# Altium project YA-IoT-Node.PrjPcb
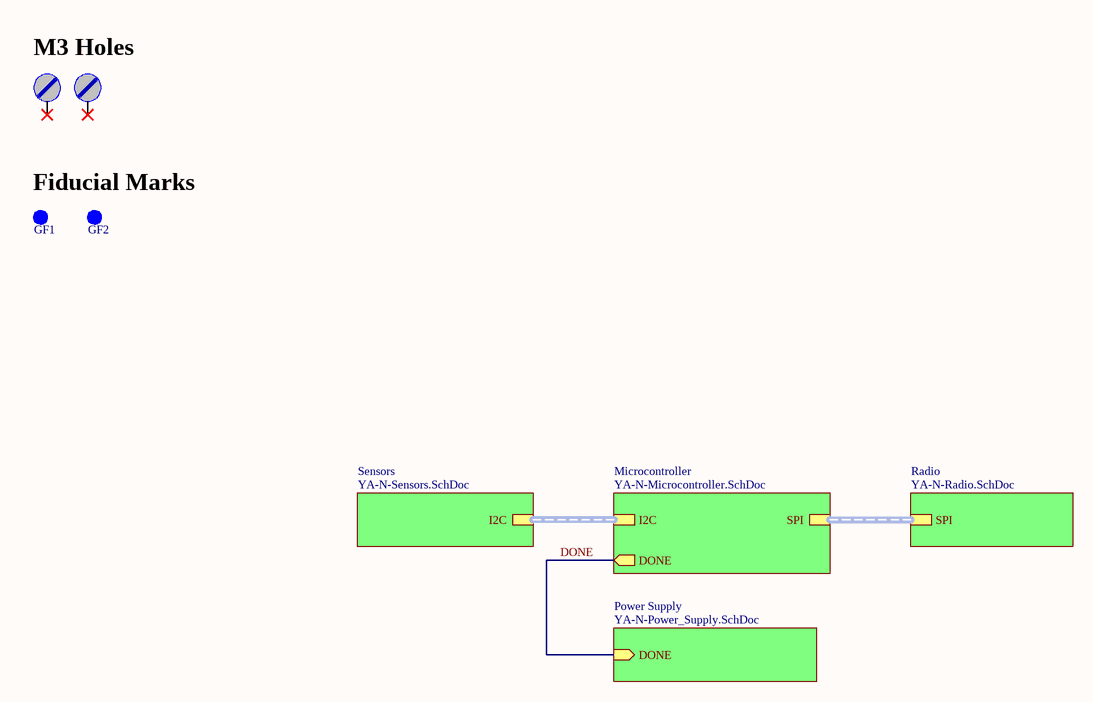
[diagram p0: YA-N-Block.SchDoc]
5 sheets, 98 parts. Net scope: hierarchical (ports join the sheet entries above them; power ports are global).
Board file: YA-N-PCB.PcbDoc
Sheets:
  YA-N-Block.SchDoc
    Sensors = YA-N-Sensors.SchDoc
    Radio = YA-N-Radio.SchDoc
    Microcontroller = YA-N-Microcontroller.SchDoc
    Power Supply = YA-N-Power_Supply.SchDoc

## Sheet YA-N-Block.SchDoc: Yet Another IoT Node - Blocks
size A4; Revision: 2.0; SheetNumber: 1; SheetTotal: 5

### Parts
GF1  Fiducial  [FIDUCIAL]  (value not drawn)  (no BOM)
GF2  Fiducial  [FIDUCIAL]  (value not drawn)  (no BOM)
M1  Furo de Fixação  [Furo_M3]  (value not drawn)  (no BOM)
M2  Furo de Fixação  [Furo_M3]  (value not drawn)  (no BOM)

### Sub-sheets
Microcontroller = YA-N-Microcontroller.SchDoc: I2C (harness I2C), SPI (harness SPI), DONE (out)
Power Supply = YA-N-Power_Supply.SchDoc: DONE (in)
Radio = YA-N-Radio.SchDoc: SPI (harness SPI)
Sensors = YA-N-Sensors.SchDoc: I2C (harness I2C)

### Nets
DONE: sheet Microcontroller/DONE, sheet Power Supply/DONE

Not connected (* = marked no-connect by the designer): M1 X*; M2 X*

### Buses and harness runs
harness sheet Microcontroller/I2C = sheet Sensors/I2C
harness sheet Microcontroller/SPI = sheet Radio/SPI

### Notes on the sheet
- M3 Holes
- Fiducial Marks
- Projeto:
- Tamanho:
- Data:
- A4
- Eng. Felipe Navarro
- Hora:
- Revisão:
- Folha
- de
- Arquivo:

### Library data of the parts
GF1 GF2 = Fiducial: Guia Fiducial; ChinesePrice: 0,00000; Chinês: ----; Corrente: *; Potência: *; Supplier 1: Digi-Key; Supplier Part Number 1: --Del; Tensão: *; Value: *; Obs:: *; Tolerância: *; ComponentLink1Description: Datasheet; ComponentLink1URL: D:\Tecnoclade\Datasheet\
M1 M2 = Parafuso: Furo para parafuso; Value: M3; ChinesePrice: 0,00000; Chinês: ----; Supplier 1: Digi-Key; Supplier Part Number 1: --Del; Corrente: *; Potência: *; Tensão: *; Tolerância: *; Obs:: *; ComponentLink1Description: Datasheet; ComponentLink1URL: D:\Tecnoclade\Datasheet\!DataMissing.pdf

## Sheet YA-N-Sensors.SchDoc: Yet Another IoT Node - Sensors
size A4; Revision: 2.0; SheetNumber: 5; SheetTotal: 5
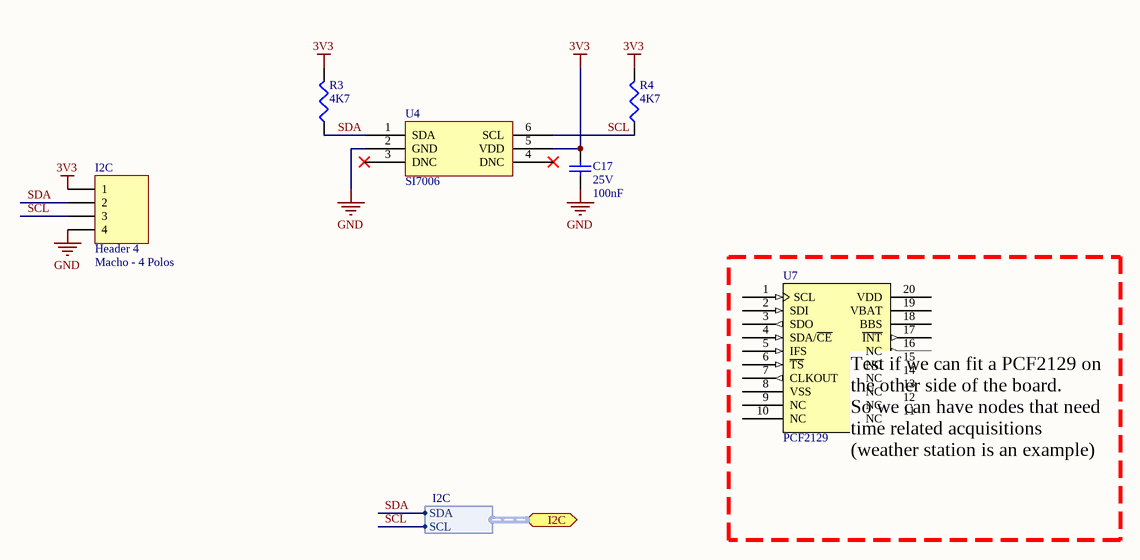
[diagram p1: YA-N-Sensors.SchDoc]

### Parts
C17  value 100nF  Tensão: 25V  [CC0603]  (hidden comment: Capacitor Cerâmico)
I2C  Header 4  value Macho - 4 Polos  [CONN HDR1X4]
R3  value 4K7  [CC0603]  (hidden comment: Resistor)
R4  value 4K7  [CC0603]  (hidden comment: Resistor)
U4  SI7006  [QFN3x3-6P]
U7  PCF2129  [SOIC-20N_WIDE]

### Ports
I2C (harness I2C)

### Harnesses
I2C: SDA, SCL

### Nets
3V3: C17.2 I2C.1 R3.2 R4.2 U4.5(VDD)
GND: C17.1 I2C.4 U4.2(GND)
SCL: I2C.3 R4.1 U4.6(SCL) ; port I2C.SCL
SDA: I2C.2 R3.1 U4.1(SDA) ; port I2C.SDA

Not connected (* = marked no-connect by the designer): U4 3(DNC)* 4(DNC)*; U7 1(SCL) 2(SDI) 3(SDO) 4(SDA/~{CE}) 5(IFS) 6(~{TS}) 7(CLKOUT) 8(VSS) 9(NC) 10(NC) 11(NC) 12(NC) 13(NC) 14(NC) 15(NC) 16(NC) 17(~{INT}) 18(BBS) 19(VBAT) 20(VDD)

### Notes on the sheet
- (near U7) Test if we can fit a PCF2129 on the other side of the board.
  So we can have nodes that need time related acquisitions (weather station is an example)
- Projeto:
- Tamanho:
- Data:
- A4
- Eng. Felipe Navarro
- Hora:
- Revisão:
- Folha
- de
- Arquivo:

### Library data of the parts
C17 = Cap 100nF 25V 0603 X7R: Capacitor (Semiconductor SIM Model); Chinês: Local; ChinesePrice: 0,00246; Corrente: *A; Potência: *W; Obs:: X7R; Tolerância: ±10%; Supplier 1: Digi-Key; Supplier Part Number 1: 490-1524-1-ND; ComponentLink1Description: Datasheet; ComponentLink1URL: D:\Tecnoclade\Datasheet\!DataMissing.pdf
I2C = Header 4: Header, 4-Pin; ChinesePrice: 0,10000; Chinês: Proved - Local; Obs:: Barra de 40 pinos - ATENÇÃO; Corrente: *; Potência: *; Supplier 1: Digi-Key; Supplier Part Number 1: A26509-40-ND; Tensão: *; Tolerância: *; ComponentLink1Description: Datasheet; ComponentLink1URL: D:\Tecnoclade\Datasheet\!DataMissing.pdf
R3 R4 = Res 4K7 1% 0603 1/10W: ChinesePrice: 0,00000; Chinês: ----; Corrente: *A; Potência: 1/10W; Tensão: *V; Obs: ±100ppm/ºC; Tolerância: ±1%; Supplier 1: Digi-Key; Supplier Part Number 1: RMCF0603FT4K70CT-ND; ComponentLink1Description: Datasheet; ComponentLink1URL: D:\Tecnoclade\Datasheet\!DataMissing.pdf
U4 = SI7006: SI7021-A20-GM1; ChinesePrice: 0,00000; Chinês: ----; Corrente: *; Potência: *; Tensão: *; Value: *; Supplier 1: Digi-Key; Supplier Part Number 1: 336-3141-ND; Obs:: *; Tolerância: *; ComponentLink1Description: Datasheet; ComponentLink1URL: https://www.silabs.com/Support%20Documents%2FTechnicalDocs%2FSi7006-A20.pdf
U7 = PCF2129: Accurate RTC with integrated quartz crystal for industrial applications; ChinesePrice: 0,00000; Chinês: ----; Corrente: *; Potência: *; Supplier 1: Digi-Key; Supplier Part Number 1: 568-9817-1-ND; Tensão: *; Value: *; Obs:: *; Tolerância: *; ComponentLink1Description: Datasheet; ComponentLink1URL: D:\Tecnoclade\Datasheet\

## Sheet YA-N-Radio.SchDoc: Yet Another IoT Node - Radio
size A4; Revision: 2.0; SheetNumber: 4; SheetTotal: 5
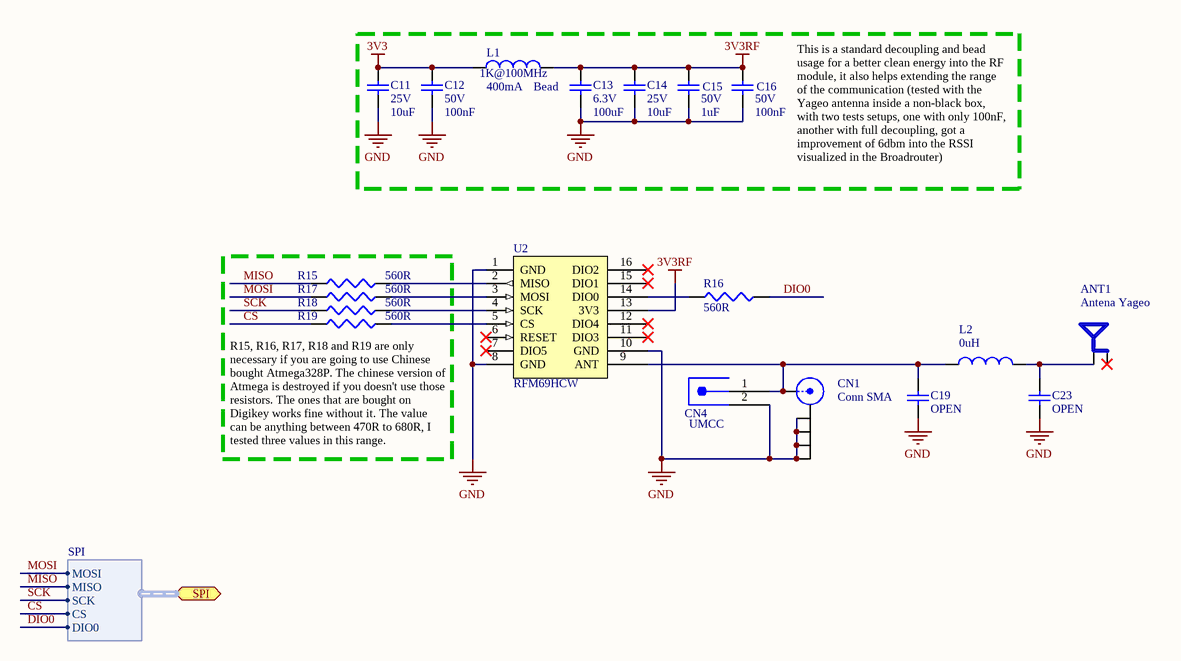
[diagram p2: YA-N-Radio.SchDoc]

### Parts
ANT1  value Antena Yageo  [ANT1204LL05R0915A]  (hidden comment: Antena)
C11  value 10uF  Tensão: 25V  [CC0805]  (hidden comment: Capacitor Cerâmico)
C12  value 100nF  Tensão: 50V  [CC0603]  (hidden comment: Capacitor Cerâmico)
C13  value 100uF  Tensão: 6.3V  [CC1206]  (hidden comment: Capacitor Cerâmico)
C14  value 10uF  Tensão: 25V  [CC0805]  (hidden comment: Capacitor Cerâmico)
C15  value 1uF  Tensão: 50V  [CC0603]  (hidden comment: Capacitor Cerâmico)
C16  value 100nF  Tensão: 50V  [CC0603]  (hidden comment: Capacitor Cerâmico)
C19  value OPEN  [CC0603]  (hidden comment: Capacitor Cerâmico)  (no BOM)
C23  value OPEN  [CC0603]  (hidden comment: Capacitor Cerâmico)  (no BOM)
CN1  Conn SMA  [CONN SMA-JACK]
CN4  UMCC  [CONN U.FL]
L1  Bead  value 1K@100MHz  Corrente: 400mA  [CC0603]
L2  value 0uH  [CC0603]  (hidden comment: Bead)
R15  value 560R  [CC0603]  (hidden comment: Resistor)
R16  value 560R  [CC0603]  (hidden comment: Resistor)
R17  value 560R  [CC0603]  (hidden comment: Resistor)
R18  value 560R  [CC0603]  (hidden comment: Resistor)
R19  value 560R  [CC0603]  (hidden comment: Resistor)
U2  RFM69HCW  [RFM69HCW]

### Ports
SPI (harness SPI)

### Harnesses
SPI: MOSI, MISO, SCK, CS, DIO0

### Nets
3V3: C11.2 C12.2 L1.1
3V3RF: C13.2 C14.2 C15.2 C16.2 L1.2 U2.13(3V3)
GND: C11.1 C12.1 C13.1 C14.1 C15.1 C16.1 C19.1 C23.1 CN1.2(Y) CN1.3(Y) CN1.4(Y) CN1.5(Y) CN4.2 U2.1(GND) U2.8(GND) U2.10(GND)
CS: R19.1 ; port SPI.CS
DIO0: R16.2 ; port SPI.DIO0
MISO: R15.1 ; port SPI.MISO
MOSI: R17.1 ; port SPI.MOSI
SCK: R18.1 ; port SPI.SCK
NetANT1_1: ANT1.1 C23.2 L2.2
NetC19_2: C19.2 CN1.1(X) CN4.1 L2.1 U2.9(ANT)
NetR15_2: R15.2 U2.2(MISO)
NetR16_1: R16.1 U2.14(DIO0)
NetR17_2: R17.2 U2.3(MOSI)
NetR18_2: R18.2 U2.4(SCK)
NetR19_2: R19.2 U2.5(CS)

Not connected (* = marked no-connect by the designer): ANT1 2*; U2 6(RESET)* 7(DIO5)* 11(DIO3)* 12(DIO4)* 15(DIO1)* 16(DIO2)*

### Notes on the sheet
- This is a standard decoupling and bead usage for a better clean energy into the RF module, it also helps extending the range of the communication (tested with the Yageo antenna inside a non-black box, with two tests setups, one with only 100nF, another with full decoupling, got a improvement of 6dbm into the RSSI visualized in the Broadrouter)
- (near R19) R15, R16, R17, R18 and R19 are only necessary if you are going to use Chinese bought Atmega328P. The chinese version of Atmega is destroyed if you doesn't use those resistors. The ones that are bought on Digikey works fine without it. The value can be anything between 470R to 680R, I tested three values in this range.
- Projeto:
- Tamanho:
- Data:
- A4
- Eng. Felipe Navarro
- Hora:
- Revisão:
- Folha
- de
- Arquivo:

### Library data of the parts
ANT1 = Antena Yageo 915Mhz: Antena YAGEO; Chinês: ----; ChinesePrice: 0,00000; Corrente: *; Potência: *; Supplier 1: Digi-Key; Supplier Part Number 1: 311-1525-1-ND; Tensão: *; Obs:: *; Tolerância: *; ComponentLink1Description: Datasheet; ComponentLink1URL: D:\Tecnoclade\Datasheet\
C11 C14 = Cap 10uF 25V 0805 X5R: Capacitor (Semiconductor SIM Model); Chinês: Local; ChinesePrice: 0,02620; Corrente: *A; Potência: *W; Obs:: X5R; Tolerância: ±10%; Supplier 1: Digi-Key; Supplier Part Number 1: 587-2985-1-ND; ComponentLink1Description: Datasheet; ComponentLink1URL: D:\Tecnoclade\Datasheet\!DataMissing.pdf
C12 C16 = Cap 100nF 50V 0603 X7R: Capacitor (Semiconductor SIM Model); Chinês: Local; ChinesePrice: 0,00250; Corrente: *A; Potência: *W; Obs:: X7R; Tolerância: ±10%; Supplier 1: Digi-Key; Supplier Part Number 1: 1276-1000-1-ND; ComponentLink1Description: Datasheet; ComponentLink1URL: D:\Tecnoclade\Datasheet\!DataMissing.pdf
C13 = Cap 100uF 6.3V 1206 X5R: Capacitor (Semiconductor SIM Model); Chinês: -----; ChinesePrice: 0,00000; Corrente: *A; Potência: *W; Obs:: X5R; Tolerância: ±20%; Supplier 1: Digi-Key; Supplier Part Number 1: 490-7217-1-ND; ComponentLink1Description: Datasheet; ComponentLink1URL: D:\Tecnoclade\Datasheet\!DataMissing.pdf
C15 = Cap 1uF 50V 0603 X5R: Capacitor (Semiconductor SIM Model); Chinês: Local; ChinesePrice: 0,01100; Corrente: *A; Potência: *W; Obs:: X5R; Tolerância: ±10%; Supplier 1: Digi-Key; Supplier Part Number 1: 587-2400-1-ND; ComponentLink1Description: Datasheet; ComponentLink1URL: D:\Tecnoclade\Datasheet\!DataMissing.pdf
C19 C23 = Cap OPEN 0603: Capacitor (Semiconductor SIM Model); Chinês: -----; ChinesePrice: 0,00000; Corrente: *A; Potência: *W; Tolerância: ±*%; Tensão: *V; Supplier 1: Digi-Key; Supplier Part Number 1: --Del; Obs:: *; ComponentLink1Description: Datasheet; ComponentLink1URL: D:\Tecnoclade\Datasheet\!DataMissing.pdf
CN1 = Conn SMA: Conector SMA; ChinesePrice: 0,00000; Chinês: ----; Corrente: *; Potência: *; Supplier 1: Digi-Key; Supplier Part Number 1: A97593-ND; Tensão: *; Value: SMA; Obs:: *; Tolerância: *; ComponentLink1Description: Datasheet; ComponentLink1URL: D:\Tecnoclade\Datasheet\!DataMissing.pdf
CN4 = Conn UMCC TE: ChinesePrice: 0,00000; Chinês: ----; Value: *; Corrente: *; Potência: *; Supplier 1: Digi-Key; Supplier Part Number 1: A118077CT-ND; Tensão: *; Obs:: *; Tolerância: *; ComponentLink1Description: Datasheet; ComponentLink1URL: D:\Tecnoclade\Datasheet\!DataMissing.pdf
L1 = Bd 1K@100MHz 0603 400mA: ChinesePrice: 0,00000; Chinês: -----; Obs:: Ferrite (0R5); Tolerância: ±25%; Potência: *; Supplier 1: Digi-Key; Supplier Part Number 1: 445-1550-1-ND; Tensão: *; ComponentLink1Description: Datasheet; ComponentLink1URL: D:\Tecnoclade\Datasheet\!DataMissing.pdf; Substituição: 27/06/2014
L2 = Bd 1K@100MHz 0603 400mA: ChinesePrice: 0,00000; Chinês: -----; Obs:: Ferrite (0R5); Tolerância: ±25%; Corrente: 400mA; Potência: *; Supplier 1: Digi-Key; Supplier Part Number 1: 712-1432-1-ND; Tensão: *; ComponentLink1Description: Datasheet; ComponentLink1URL: D:\Tecnoclade\Datasheet\!DataMissing.pdf; Substituição: 27/06/2014
R15-R19 = Res 560R 1% 0603 1/10w: ChinesePrice: 0,00000; Chinês: ----; Corrente: *A; Potência: 1/10W; Tensão: *V; Tolerância: ±*%; Supplier 1: Digi-Key; Supplier Part Number 1: 311-560HRCT-ND; Obs:: *; ComponentLink1Description: Datasheet; ComponentLink1URL: D:\Tecnoclade\Datasheet\!DataMissing.pdf
U2 = RFM69HCW: Memória; ChinesePrice: 4,34; Chinês: Local; Value: Rádio 915Mhz; Corrente: *; Potência: *; Supplier 1: Digi-Key; Supplier Part Number 1: --Del; Tensão: *; Obs:: *; Tolerância: *; ComponentLink1Description: Datasheet; ComponentLink1URL: D:\Tecnoclade\Datasheet\!DataMissing.pdf

## Sheet YA-N-Microcontroller.SchDoc: Yet Another IoT Node - uController
size A4; Revision: 2.0; SheetNumber: 3; SheetTotal: 5
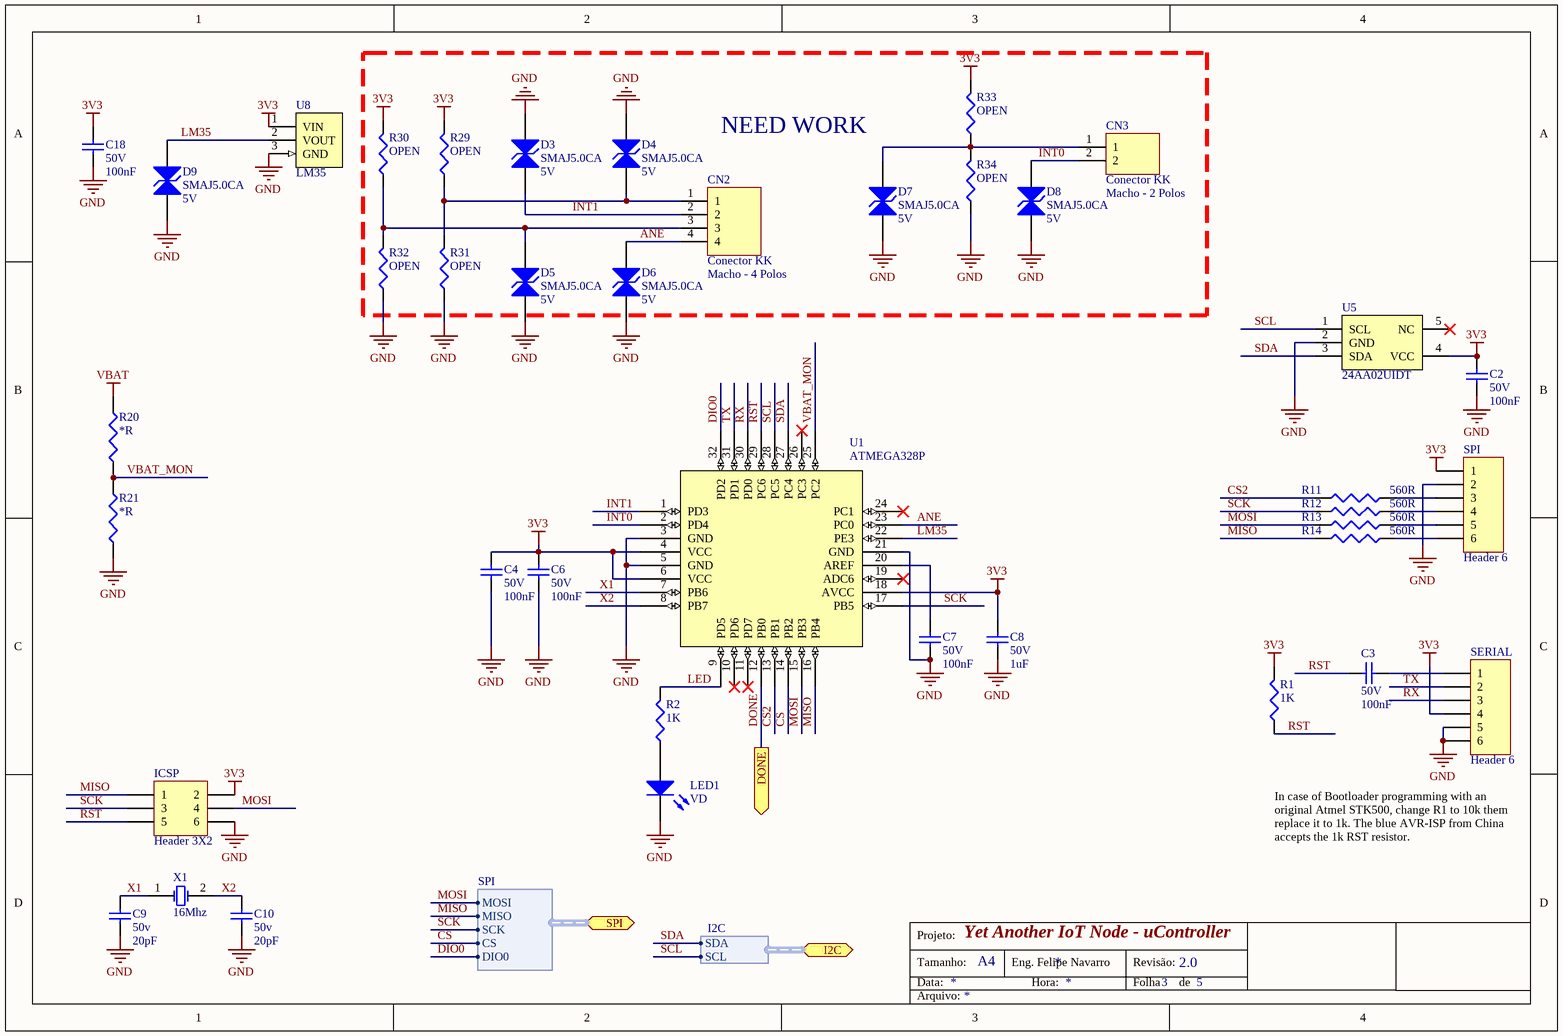
[diagram p3: YA-N-Microcontroller.SchDoc]

### Parts
(Parts that share a designator on the sheet are numbered #1, #2 ... from top to bottom, then left to right.)
C2  value 100nF  Tensão: 50V  [CC0603]  (hidden comment: Capacitor Cerâmico)
C3  value 100nF  Tensão: 50V  [CC0603]  (hidden comment: Capacitor Cerâmico)
C4  value 100nF  Tensão: 50V  [CC0603]  (hidden comment: Capacitor Cerâmico)
C6  value 100nF  Tensão: 50V  [CC0603]  (hidden comment: Capacitor Cerâmico)
C7  value 100nF  Tensão: 50V  [CC0603]  (hidden comment: Capacitor Cerâmico)
C8  value 1uF  Tensão: 50V  [CC0603]  (hidden comment: Capacitor Cerâmico)
C9  value 20pF  Tensão: 50v  [CC0603]  (hidden comment: Capacitor Cerâmico)
C10  value 20pF  Tensão: 50v  [CC0603]  (hidden comment: Capacitor Cerâmico)
C18  value 100nF  Tensão: 50V  [CC0603]  (hidden comment: Capacitor Cerâmico)
CN2  Conector KK  value Macho - 4 Polos  [CONN HDR4-POL P.100]
CN3  Conector KK  value Macho - 2 Polos  [CONN HDR2-POL P.100]
D3#1  SMAJ5.0CA  Tensão: 5V  [SMA BIDIR]
D4  SMAJ5.0CA  Tensão: 5V  [SMA BIDIR]
D5  SMAJ5.0CA  Tensão: 5V  [SMA BIDIR]
D6  SMAJ5.0CA  Tensão: 5V  [SMA BIDIR]
D7  SMAJ5.0CA  Tensão: 5V  [SMA BIDIR]
D8  SMAJ5.0CA  Tensão: 5V  [SMA BIDIR]
D9  SMAJ5.0CA  Tensão: 5V  [SMA BIDIR]
ICSP  Header 3X2  [CONN HDR2X3]
LED1  value VD  [LED 0603]  (hidden comment: LED)
R1  value 1K  [CC0603]  (hidden comment: Resistor)
R2  value 1K  [CC0603]  (hidden comment: Resistor)
R11  value 560R  [CC0603]  (hidden comment: Resistor)
R12  value 560R  [CC0603]  (hidden comment: Resistor)
R13  value 560R  [CC0603]  (hidden comment: Resistor)
R14  value 560R  [CC0603]  (hidden comment: Resistor)
R20  value *R  [CC0603]  (hidden comment: Resistor)
R21  value *R  [CC0603]  (hidden comment: Resistor)
R29  value OPEN  [CC0603]  (hidden comment: Resistor Open)  (no BOM)
R30  value OPEN  [CC0603]  (hidden comment: Resistor Open)  (no BOM)
R31  value OPEN  [CC0603]  (hidden comment: Resistor Open)  (no BOM)
R32  value OPEN  [CC0603]  (hidden comment: Resistor Open)  (no BOM)
R33  value OPEN  [CC0603]  (hidden comment: Resistor Open)  (no BOM)
R34  value OPEN  [CC0603]  (hidden comment: Resistor Open)  (no BOM)
SERIAL  Header 6  [CONN HDR1X6]
SPI  Header 6  [CONN HDR1X6]
U1  ATMEGA328P  [TQFP-32N]
U5  24AA02UIDT  [SOT-23-5N]
U8  LM35  [CONN HDR3-POL P.100]
X1  16Mhz  [HC/49US]

### Blocks framed on the sheet
NEED WORK: CN2 CN3 D3#1 D4-D8 R29-R34

### Ports
DONE (out), I2C (harness I2C), SPI (harness SPI)

### Harnesses
I2C: SDA, SCL
SPI: MOSI, MISO, SCK, CS, DIO0

### Nets
3V3: C2.2 C4.2 C6.2 C8.2 C18.2 ICSP.2 R1.2 R29.2 R30.2 R33.2 SERIAL.4 SPI.1 U1.4(VCC) U1.6(VCC) U1.18(AVCC) U5.4(VCC) U8.1(VIN)
GND: C2.1 C4.1 C6.1 C7.1 C8.1 C9.1 C10.1 C18.1 D3#1.2(K) D4.2(K) D5.1(A) D6.1(A) D7.1(A) D8.1(A) D9.1(A) ICSP.6 LED1.2(K) R21.1 R31.1 R32.1 R34.1 SERIAL.5 SERIAL.6 SPI.2 U1.3(GND) U1.5(GND) U1.21(GND) U5.2(GND) U8.3(GND)
VBAT: R20.2
ANE: CN2.4 D6.2(K) U1.23(PC0)
CS: U1.14(PB2) ; port SPI.CS
CS2: R11.1 U1.13(PB1)
DIO0: U1.32(PD2) ; port SPI.DIO0
DONE: U1.12(PB0) ; port DONE
INT0: CN3.2 D8.2(K) U1.2(PD4)
INT1: CN2.2 D3#1.1(A) U1.1(PD3)
LED: R2.2 U1.9(PD5)
LM35: D9.2(K) U1.22(PE3) U8.2(VOUT)
MISO: ICSP.1 R14.1 U1.16(PB4) ; port SPI.MISO
MOSI: ICSP.4 R13.1 U1.15(PB3) ; port SPI.MOSI
RST: C3.2 ICSP.5 R1.1 U1.29(PC6)
RX: SERIAL.3 U1.30(PD0)
SCK: ICSP.3 R12.1 U1.17(PB5) ; port SPI.SCK
SCL: U1.28(PC5) U5.1(SCL) ; port I2C.SCL
SDA: U1.27(PC4) U5.3(SDA) ; port I2C.SDA
TX: SERIAL.2 U1.31(PD1)
VBAT_MON: R20.1 R21.2 U1.25(PC2)
X1: C9.2 U1.7(PB6) X1.1(OSC1)
X2: C10.2 U1.8(PB7) X1.2(OSC2)
NetC3_1: C3.1 SERIAL.1
NetC7_2: C7.2 U1.20(AREF)
NetCN2_1: CN2.1 D4.1(A) R29.1 R31.2
NetCN2_3: CN2.3 D5.2(K) R30.1 R32.2
NetCN3_1: CN3.1 D7.2(K) R33.1 R34.2
NetLED1_1: LED1.1(A) R2.1
NetR11_2: R11.2 SPI.3
NetR12_2: R12.2 SPI.4
NetR13_2: R13.2 SPI.5
NetR14_2: R14.2 SPI.6

Not connected (* = marked no-connect by the designer): U1 10(PD6)* 11(PD7)* 19(ADC6)* 24(PC1)* 26(PC3)*; U5 5(NC)*

### Notes on the sheet
- In case of Bootloader programming with an original Atmel STK500, change R1 to 10k them replace it to 1k. The blue AVR-ISP from China accepts the 1k RST resistor.
- Projeto:
- Tamanho:
- Data:
- A4
- Eng. Felipe Navarro
- Hora:
- Revisão:
- Folha
- de
- Arquivo:

### Library data of the parts
C2-C4 C6 C7 C18 = Cap 100nF 50V 0603 X7R: as C12 on sheet YA-N-Radio; Supplier 1: Digi-Key; Supplier Part Number 1: 1276-1000-1-ND; ComponentLink1Description: Datasheet; ComponentLink1URL: D:\Tecnoclade\Datasheet\!DataMissing.pdf
C8 = Cap 1uF 50V 0603 X5R: as C15 on sheet YA-N-Radio; Supplier 1: Digi-Key; Supplier Part Number 1: 587-2400-1-ND; ComponentLink1Description: Datasheet; ComponentLink1URL: D:\Tecnoclade\Datasheet\!DataMissing.pdf
C9 C10 = Cap - $Val $V $Footprint $Classe_1: Capacitor (Semiconductor SIM Model); Chinês: ----; ChinesePrice: 0,00000; Corrente: *A; Potência: *W; Tolerância: ±*%; Supplier 1: Digi-Key; Supplier Part Number 1: 1276-1187-1-ND; Obs:: *; ComponentLink1Description: Datasheet; ComponentLink1URL: D:\Tecnoclade\Datasheet\!DataMissing.pdf
CN2 = KK 4P Macho-V P2.54mm: ChinesePrice: 0,00000; Chinês: ----; Corrente: *; Potência: *; Supplier 1: Digi-Key; Supplier Part Number 1: A19431-ND; Tensão: *; Obs:: *; Tolerância: *; ComponentLink1Description: Datasheet; ComponentLink1URL: D:\Tecnoclade\Datasheet\!DataMissing.pdf
CN3 = KK 2P Macho-V P2.54mm: ChinesePrice: 0,01400; Chinês: Local; Corrente: *; Potência: *; Supplier 1: Digi-Key; Supplier Part Number 1: A19423-ND; Tensão: *; Obs:: *; Tolerância: *; ComponentLink1Description: Datasheet; ComponentLink1URL: D:\Tecnoclade\Datasheet\!DataMissing.pdf
D3#1 D4-D9 = TVS 5V 5% SMA BI 400W: Transient Voltage Supressor diode; ChinesePrice: 0,00000; Chinês: ----; Potência: 400W; Value: TVS; Obs:: Bidirecional; Tolerância: ±5%; Corrente: *; Supplier 1: Digi-Key; Supplier Part Number 1: SMAJ5.0CABCT-ND; ComponentLink1Description: Datasheet; ComponentLink1URL: D:\Tecnoclade\Datasheet\!DataMissing.pdf
ICSP = Header 3X2: Header, 5-Pin, Dual row; ChinesePrice: 0,00000; Chinês: ----; Value: Macho; Obs:: Barra dupla de 40 pinos - ATENÇÃO; Corrente: *; Potência: *; Supplier 1: Digi-Key; Supplier Part Number 1: 609-3724-ND; Tensão: *; Tolerância: *; ComponentLink1Description: Datasheet; ComponentLink1URL: D:\Tecnoclade\Datasheet\!DataMissing.pdf
LED1 = LED 0603 VD 2V 75mW: ChinesePrice: 0,02810; Chinês: Local; Corrente: 20mA; Potência: 75mW; Tensão: 2V; Obs:: 35mcd@130º; Supplier 1: Digi-Key; Supplier Part Number 1: 160-1478-1-ND; Tolerância: *; ComponentLink1Description: Datasheet; ComponentLink1URL: D:\Tecnoclade\Datasheet\!DataMissing.pdf
R1 = Res 10K 1% 0603 1/10W: ChinesePrice: 0,00089; Chinês: Local; Corrente: *A; Potência: 1/10W; Tensão: *V; Tolerância: ±1%; Supplier 1: Digi-Key; Supplier Part Number 1: RMCF0603FT1K00CT-ND; Obs: *; ComponentLink1Description: Datasheet; ComponentLink1URL: D:\Tecnoclade\Datasheet\!DataMissing.pdf
R2 = Res 1K 1% 0603 1/10W: ChinesePrice: 0,00089; Chinês: Local; Corrente: *A; Potência: 1/10W; Tensão: *V; Tolerância: ±1%; Supplier 1: Digi-Key; Supplier Part Number 1: RMCF0603FT1K00CT-ND; Obs: *; ComponentLink1Description: Datasheet; ComponentLink1URL: D:\Tecnoclade\Datasheet\!DataMissing.pdf
R11-R14 = Res 560R 1% 0603 1/10w: as R15 on sheet YA-N-Radio; Supplier 1: Digi-Key; Supplier Part Number 1: 311-560HRCT-ND; Obs:: *; ComponentLink1Description: Datasheet; ComponentLink1URL: D:\Tecnoclade\Datasheet\!DataMissing.pdf
R20 R21 = Res - $Val $% $Footprint $Pot: ChinesePrice: 0,00000; Chinês: ----; Corrente: *A; Potência: 1/10W; Tensão: *V; Tolerância: ±*%; Supplier 1: Digi-Key; Supplier Part Number 1: --Del; Obs:: *; ComponentLink1Description: Datasheet; ComponentLink1URL: D:\Tecnoclade\Datasheet\!DataMissing.pdf
R29-R34 = Res Open 0603: Resistor; ChinesePrice: 0,00000; Chinês: ----; Corrente: *A; Potência: *W; Tensão: *V; Tolerância: ±*%; Supplier 1: Digi-Key; Supplier Part Number 1: --Del; Obs:: *; ComponentLink1Description: Datasheet; ComponentLink1URL: D:\Tecnoclade\Datasheet\!DataMissing.pdf
SERIAL SPI = Header 6: Header, 6-Pin; ChinesePrice: 0,10000; Chinês: Proved - Local; Value: Barra de 40 pinos - ATENÇÃO; Corrente: *; Potência: *; Supplier 1: Digi-Key; Supplier Part Number 1: A26509-40-ND; Tensão: *; Obs:: *; Tolerância: *; ComponentLink1Description: Datasheet; ComponentLink1URL: D:\Tecnoclade\Datasheet\!DataMissing.pdf
U1 = ATMEGA328P: IC MCU 32KB FLASH 20MHZ 32TQFP; ChinesePrice: 0,00000; Chinês: ----; Supplier 1: Digi-Key; Supplier Part Number 1: ATMEGA328P-AN-ND; Tensão: *; Corrente: *; Potência: *; Value: *; Obs:: *; Tolerância: *; ComponentLink1Description: Datasheet; ComponentLink1URL: D:\Tecnoclade\Datasheet\
U5 = 24AA02UIDT: IC EEPROM 2KBIT 400KHZ SOT23-5; Tensão: 3V3; ChinesePrice: 0,00000; Chinês: ----; Corrente: 200mA; Potência: *; Supplier 1: Digi-Key; Supplier Part Number 1: 24AA02UIDT-I/OTCT-ND; Value: *; Obs:: *; Tolerância: *; ComponentLink1Description: Datasheet; ComponentLink1URL: D:\Tecnoclade\Datasheet\
U8 = LM35: SIMPLE LM35 Precision Centigrade Temperature Sensors; ChinesePrice: 0,00000; Chinês: ----; Tensão: 3V3; Value: 1MHz; Potência: *; Supplier 1: Digi-Key; Supplier Part Number 1: LM35DZ/NOPB-ND; Tolerância: *; ComponentLink1Description: Datasheet; ComponentLink1URL: http://www.ti.com/lit/ds/symlink/lm35.pdf
X1 = XTAL: Crystal Oscillator; ChinesePrice: 0,00000; Chinês: ----; Value: 20pF/40R; Corrente: *; Potência: *; Supplier 1: Digi-Key; Supplier Part Number 1: 535-10226-1-ND; Tensão: *; Obs:: *; Tolerância: *

## Sheet YA-N-Power_Supply.SchDoc: Yet Another IoT Node - Power
size A4; Revision: 2.0; SheetNumber: 2; SheetTotal: 5
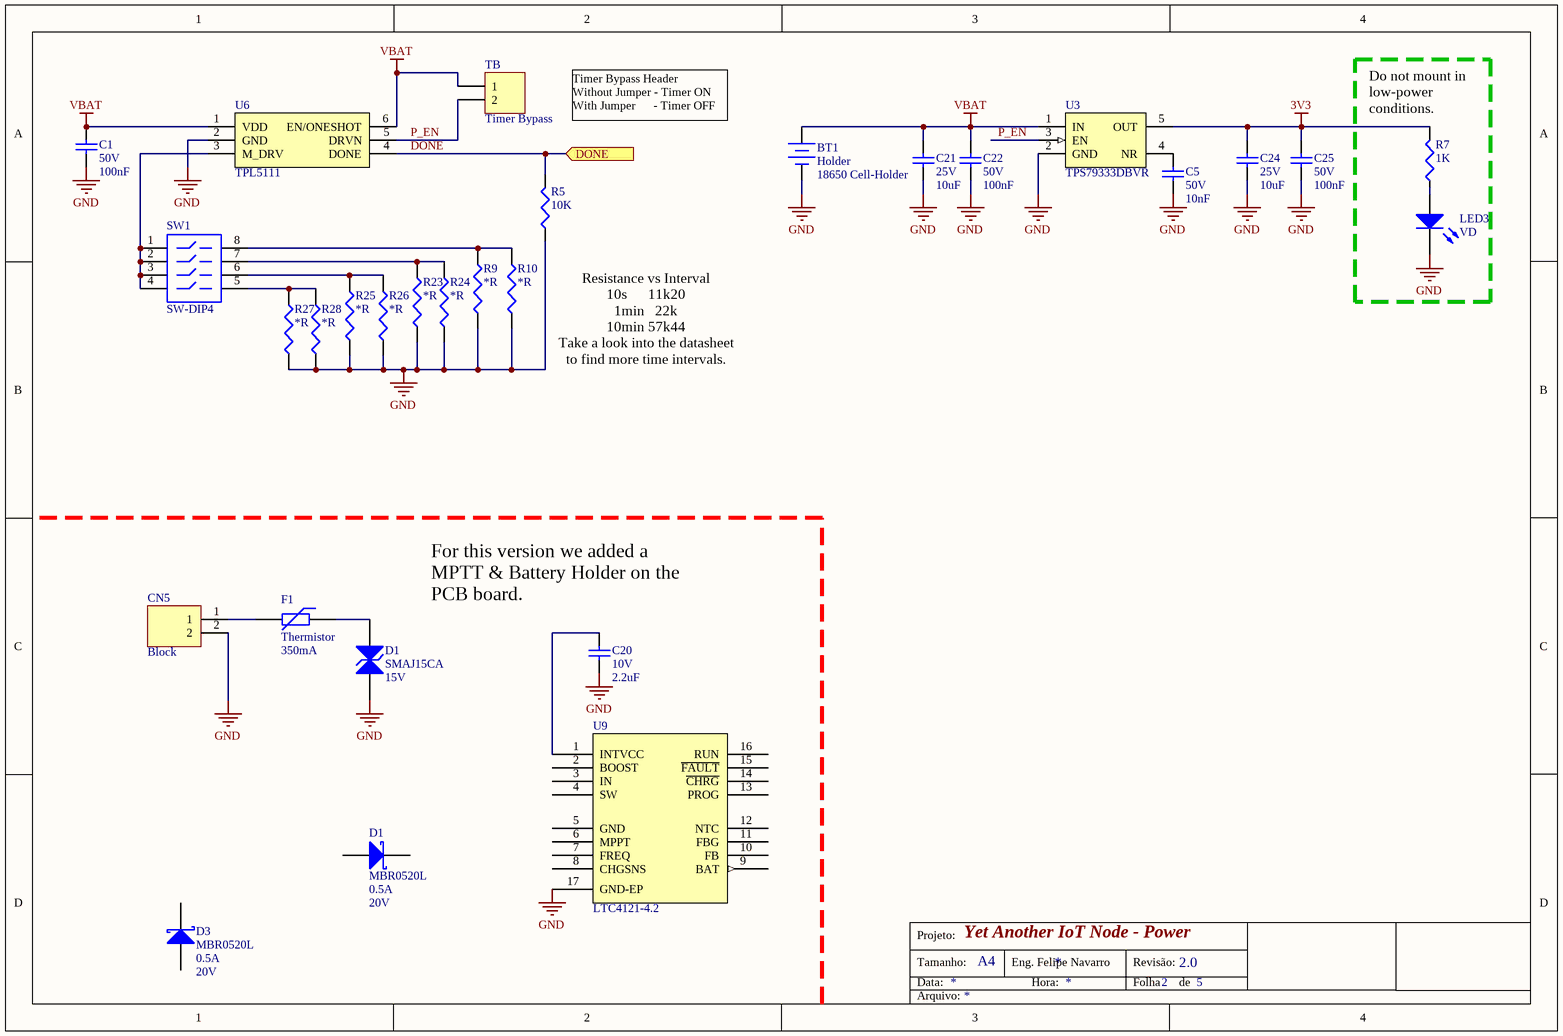
[diagram p4: YA-N-Power_Supply.SchDoc]

### Parts
(Parts that share a designator on the sheet are numbered #1, #2 ... from top to bottom, then left to right.)
BT1  Holder  value 18650 Cell-Holder  [KEYSTONE 54]
C1  value 100nF  Tensão: 50V  [CC0603]  (hidden comment: Capacitor Cerâmico)
C5  value 10nF  Tensão: 50V  [CC0603]  (hidden comment: Capacitor Cerâmico)
C20  value 2.2uF  Tensão: 10V  [CC0805]  (hidden comment: Capacitor Cerâmico)
C21  value 10uF  Tensão: 25V  [CC0805]  (hidden comment: Capacitor Cerâmico)
C22  value 100nF  Tensão: 50V  [CC0603]  (hidden comment: Capacitor Cerâmico)
C24  value 10uF  Tensão: 25V  [CC0805]  (hidden comment: Capacitor Cerâmico)
C25  value 100nF  Tensão: 50V  [CC0603]  (hidden comment: Capacitor Cerâmico)
CN5  Block  [CONN SHRD.BL2 RCPT/H]
D1#1  SMAJ15CA  Tensão: 15V  [SMA BIDIR]
D1#2  MBR0520L  Corrente: 0.5A  Tensão: 20V  [SOD-123F]
D3#2  MBR0520L  Corrente: 0.5A  Tensão: 20V  [SOD-123F]
F1  Thermistor  Current Hold: 350mA  [CC1206]
LED3  value VD  [LED 0603]  (hidden comment: LED)
R5  value 10K  [CC0603]  (hidden comment: Resistor)
R7  value 1K  [CC0603]  (hidden comment: Resistor)
R9  value *R  [CC0603]  (hidden comment: Resistor)
R10  value *R  [CC0603]  (hidden comment: Resistor)
R23  value *R  [CC0603]  (hidden comment: Resistor)
R24  value *R  [CC0603]  (hidden comment: Resistor)
R25  value *R  [CC0603]  (hidden comment: Resistor)
R26  value *R  [CC0603]  (hidden comment: Resistor)
R27  value *R  [CC0603]  (hidden comment: Resistor)
R28  value *R  [CC0603]  (hidden comment: Resistor)
SW1  SW-DIP4  [SWITCH-DIP8]
TB  Timer Bypass  [CONN HDR1X2]
U3  TPS79333DBVR  [SOT-23-5N]
U6  TPL5111  [TSOT-23-6N]
U9  LTC4121-4.2  [QFN3X3-17N]

### Ports
DONE (in)

### Nets
3V3: C24.2 C25.2 R7.2 U3.5(OUT)
GND: BT1.2(-) C1.1 C5.1 C20.1 C21.1 C22.1 C24.1 C25.1 CN5.2 D1#1.1(A) LED3.2(K) R5.1 R9.1 R10.1 R23.1 R24.1 R25.1 R26.1 R27.1 R28.1 U3.2(GND) U6.2(GND) U9.17(GND-EP)
VBAT: BT1.1(+) C1.2 C21.2 C22.2 TB.1 U3.1(IN) U6.1(VDD) U6.6(EN/ONESHOT)
DONE: R5.2 U6.4(DONE) ; port DONE
P_EN: TB.2 U3.3(EN) U6.5(DRVN)
NetC5_2: C5.2 U3.4(NR)
NetC20_2: C20.2 U9.1(INTVCC)
NetCN5_1: CN5.1 F1.2
NetD1#1_2: D1#1.2(K) F1.1
NetLED3_1: LED3.1(A) R7.1
NetR9_2: R9.2 R10.2 SW1.8
NetR23_2: R23.2 R24.2 SW1.7
NetR25_2: R25.2 R26.2 SW1.6
NetR27_2: R27.2 R28.2 SW1.5
NetSW1_1: SW1.1 SW1.2 SW1.3 SW1.4 U6.3(M_DRV)

Not connected (* = marked no-connect by the designer): D1#2 1(A) 2(K); D3#2 1(A) 2(K); U9 2(BOOST) 3(IN) 4(SW) 5(GND) 6(MPPT) 7(FREQ) 8(CHGSNS) 9(BAT) 10(FB) 11(FBG) 12(NTC) 13(PROG) 14(~{CHRG}) 15(~{FAULT}) 16(RUN)

### Notes on the sheet
- Timer Bypass Header
  Without Jumper - Timer ON
  With Jumper      - Timer OFF
- (near R7) Do not mount in low-power conditions.
- Resistance vs Interval
  10s      11k20
  1min   22k
  10min 57k44
  Take a look into the datasheet to find more time intervals.
- (near C20) For this version we added a MPTT & Battery Holder on the PCB board.
- Projeto:
- Tamanho:
- Data:
- A4
- Eng. Felipe Navarro
- Hora:
- Revisão:
- Folha
- de
- Arquivo:

### Library data of the parts
BT1 = BattHolder 18650: Corrente: *A; Chinês: ----; ChinesePrice: 0,00000; Tensão: *V; Potência: *; Supplier 1: Digi-Key; Supplier Part Number 1: 36-54-ND; Obs:: *; Tolerância: *; ComponentLink1Description: Datasheet; ComponentLink1URL: D:\Tecnoclade\Datasheet\
C1 C22 C25 = Cap 100nF 50V 0603 X7R: as C12 on sheet YA-N-Radio; Supplier 1: Digi-Key; Supplier Part Number 1: 1276-1000-1-ND; ComponentLink1Description: Datasheet; ComponentLink1URL: D:\Tecnoclade\Datasheet\!DataMissing.pdf
C5 = Cap 10nF 50V 0603 X7R 5%: Capacitor (Semiconductor SIM Model); Chinês: Local; ChinesePrice: 0,00320; Corrente: *A; Potência: *W; Obs:: X7R; Tolerância: ±5%; Supplier 1: Digi-Key; Supplier Part Number 1: 399-1092-1-ND; ComponentLink1Description: Datasheet; ComponentLink1URL: D:\Tecnoclade\Datasheet\!DataMissing.pdf
C20 = Cap 2.2uF 10V 0805 X7R: Capacitor (Semiconductor SIM Model); Chinês: -----; ChinesePrice: 0,00000; Corrente: *A; Potência: *W; Obs:: X7R; Tolerância: ±10%; Supplier 1: Digi-Key; Supplier Part Number 1: 587-1286-1-ND; ComponentLink1Description: Datasheet; ComponentLink1URL: D:\Tecnoclade\Datasheet\!DataMissing.pdf
C21 C24 = Cap 10uF 25V 0805 X5R: as C11 on sheet YA-N-Radio; Supplier 1: Digi-Key; Supplier Part Number 1: 587-2985-1-ND; ComponentLink1Description: Datasheet; ComponentLink1URL: D:\Tecnoclade\Datasheet\!DataMissing.pdf
CN5 = SHRD Block 2P RCPT-H P5.08mm: Conector Shrouded Block; ChinesePrice: 0,03930; Chinês: Local; Corrente: 15A; Tensão: 300V; Value: Receptáculo - 2 Polos; Potência: *; Supplier 1: Digi-Key; Supplier Part Number 1: A98065-ND; Obs:: *; Tolerância: *; ComponentLink1Description: Datasheet; ComponentLink1URL: D:\Tecnoclade\Datasheet\!DataMissing.pdf
D1#1 = TVS 15V 5% SMA BI 400W: Transient Voltage Supressor diode; ChinesePrice: 0,05900; Chinês: Local; Potência: 400W; Value: TVS; Obs:: Bidirecional; Tolerância: ±5%; Corrente: *; Supplier 1: Digi-Key; Supplier Part Number 1: SMAJ15CABCT-ND; ComponentLink1Description: Datasheet; ComponentLink1URL: D:\Tecnoclade\Datasheet\!DataMissing.pdf
D1#2 D3#2 = DS 20V 0.5A 385mV SOD-123: Schottky Diode; ChinesePrice: 0,00000; Chinês: ----; Value: Vf=385mV@500mA; Obs:: Fast Recovery =< 500ns, > 200mA (Io); Potência: *; Supplier 1: Digi-Key; Supplier Part Number 1: MBR0520L-TPMSCT-ND; Tolerância: *; ComponentLink1Description: Datasheet; ComponentLink1URL: D:\Tecnoclade\Datasheet\!DataMissing.pdf
F1 = Res Varistor: Varistor (Voltage-Sensitive Resistor); Tensão: 30v; ChinesePrice: 0,09500; Chinês: Local; Supplier 1: Digi-Key; Supplier Part Number 1: 507-1800-1-ND; ComponentLink1Description: Datasheet; ComponentLink1URL: D:\Tecnoclade\Datasheet\!DataMissing.pdf
LED3 = LED 0603 VD 2V 75mW: as LED1 on sheet YA-N-Microcontroller; Supplier 1: Digi-Key; Supplier Part Number 1: 160-1478-1-ND; Tolerância: *; ComponentLink1Description: Datasheet; ComponentLink1URL: D:\Tecnoclade\Datasheet\!DataMissing.pdf
R5 = Res 10K 1% 0603 1/10W: as R1 on sheet YA-N-Microcontroller; Supplier 1: Digi-Key; Supplier Part Number 1: P10.0KHCT-ND; Obs: *; ComponentLink1Description: Datasheet; ComponentLink1URL: D:\Tecnoclade\Datasheet\!DataMissing.pdf
R7 = Res 1K 1% 0603 1/10W: as R2 on sheet YA-N-Microcontroller; Supplier 1: Digi-Key; Supplier Part Number 1: RMCF0603FT1K00CT-ND; Obs: *; ComponentLink1Description: Datasheet; ComponentLink1URL: D:\Tecnoclade\Datasheet\!DataMissing.pdf
R9 R10 R23-R28 = Res - $Val $% $Footprint $Pot: as R20 on sheet YA-N-Microcontroller; Supplier 1: Digi-Key; Supplier Part Number 1: --Del; Obs:: *; ComponentLink1Description: Datasheet; ComponentLink1URL: D:\Tecnoclade\Datasheet\!DataMissing.pdf
SW1 = SW-DIP4: 4009 Series DIP Switch, Raised actuator; Value: SPST; ChinesePrice: 0,00000; Chinês: ----; Corrente: *; Potência: *; Supplier 1: Digi-Key; Supplier Part Number 1: --Del; Tensão: *; Obs:: *; Tolerância: *; ComponentLink1Description: Datasheet; ComponentLink1URL: D:\Tecnoclade\Datasheet\
TB = Header 2: Header, 2-Pin; ChinesePrice: 0,10000; Chinês: Proved - Local; Value: Barra de 40 pinos - ATENÇÃO; Corrente: *; Potência: *; Supplier 1: Digi-Key; Supplier Part Number 1: A26509-40-ND; Tensão: *; Obs:: *; Tolerância: *; ComponentLink1Description: Datasheet; ComponentLink1URL: D:\Tecnoclade\Datasheet\!DataMissing.pdf
U3 = TPS79333: ULTRALOW-NOISE, HIGH PSRR, FAST RF 200mA LOW-DROPOUT LINEAR  REGULATORS I; Tensão: 3V3; ChinesePrice: 0,00000; Chinês: ----; Corrente: 200mA; Potência: *; Supplier 1: Digi-Key; Supplier Part Number 1: 296-12961-1-ND; Value: *; Obs:: *; Tolerância: *; ComponentLink1Description: Datasheet; ComponentLink1URL: D:\Tecnoclade\Datasheet\
U6 = TPL5111: Nano-Power System Timer for Power Gating; Chinês: Local; Corrente: *; Potência: *; Supplier 1: Digi-Key; Supplier Part Number 1: 296-42621-1-ND; Tensão: *; Obs:: *; Tolerância: *; ComponentLink1Description: Datasheet; ComponentLink1URL: D:\Tecnoclade\Datasheet\!DataMissing.pdf
U9 = LTC4121-4.2: 40V 400mA Synchronous  Step-Down Battery Charger; ChinesePrice: 0,00000; Chinês: ----; Supplier 1: Digi-Key; Supplier Part Number 1: LTC4121IUD#PBF-ND; Corrente: *; Potência: *; Tensão: *; Value: *; Obs:: *; Tolerância: *; ComponentLink1Description: Datasheet

## Nets that join several sheets
3V3: YA-N-Sensors (5 pins), YA-N-Radio (C11.2 C12.2 L1.1), YA-N-Microcontroller (17 pins), YA-N-Power_Supply (C24.2 C25.2 R7.2 U3.5)
GND: YA-N-Sensors (C17.1 I2C.4 U4.2), YA-N-Radio (16 pins), YA-N-Microcontroller (29 pins), YA-N-Power_Supply (23 pins)
VBAT: YA-N-Microcontroller (R20.2), YA-N-Power_Supply (8 pins)
CS: YA-N-Radio (R19.1), YA-N-Microcontroller (U1.14)
DIO0: YA-N-Radio (R16.2), YA-N-Microcontroller (U1.32)
DONE: YA-N-Microcontroller (U1.12), YA-N-Power_Supply (R5.2 U6.4)
MISO: YA-N-Radio (R15.1), YA-N-Microcontroller (ICSP.1 R14.1 U1.16)
MOSI: YA-N-Radio (R17.1), YA-N-Microcontroller (ICSP.4 R13.1 U1.15)
SCK: YA-N-Radio (R18.1), YA-N-Microcontroller (ICSP.3 R12.1 U1.17)
SCL: YA-N-Sensors (I2C.3 R4.1 U4.6), YA-N-Microcontroller (U1.28 U5.1)
SDA: YA-N-Sensors (I2C.2 R3.1 U4.1), YA-N-Microcontroller (U1.27 U5.3)